# Altium schematic sheet ConectoresAdicionales.SchDoc
size A4
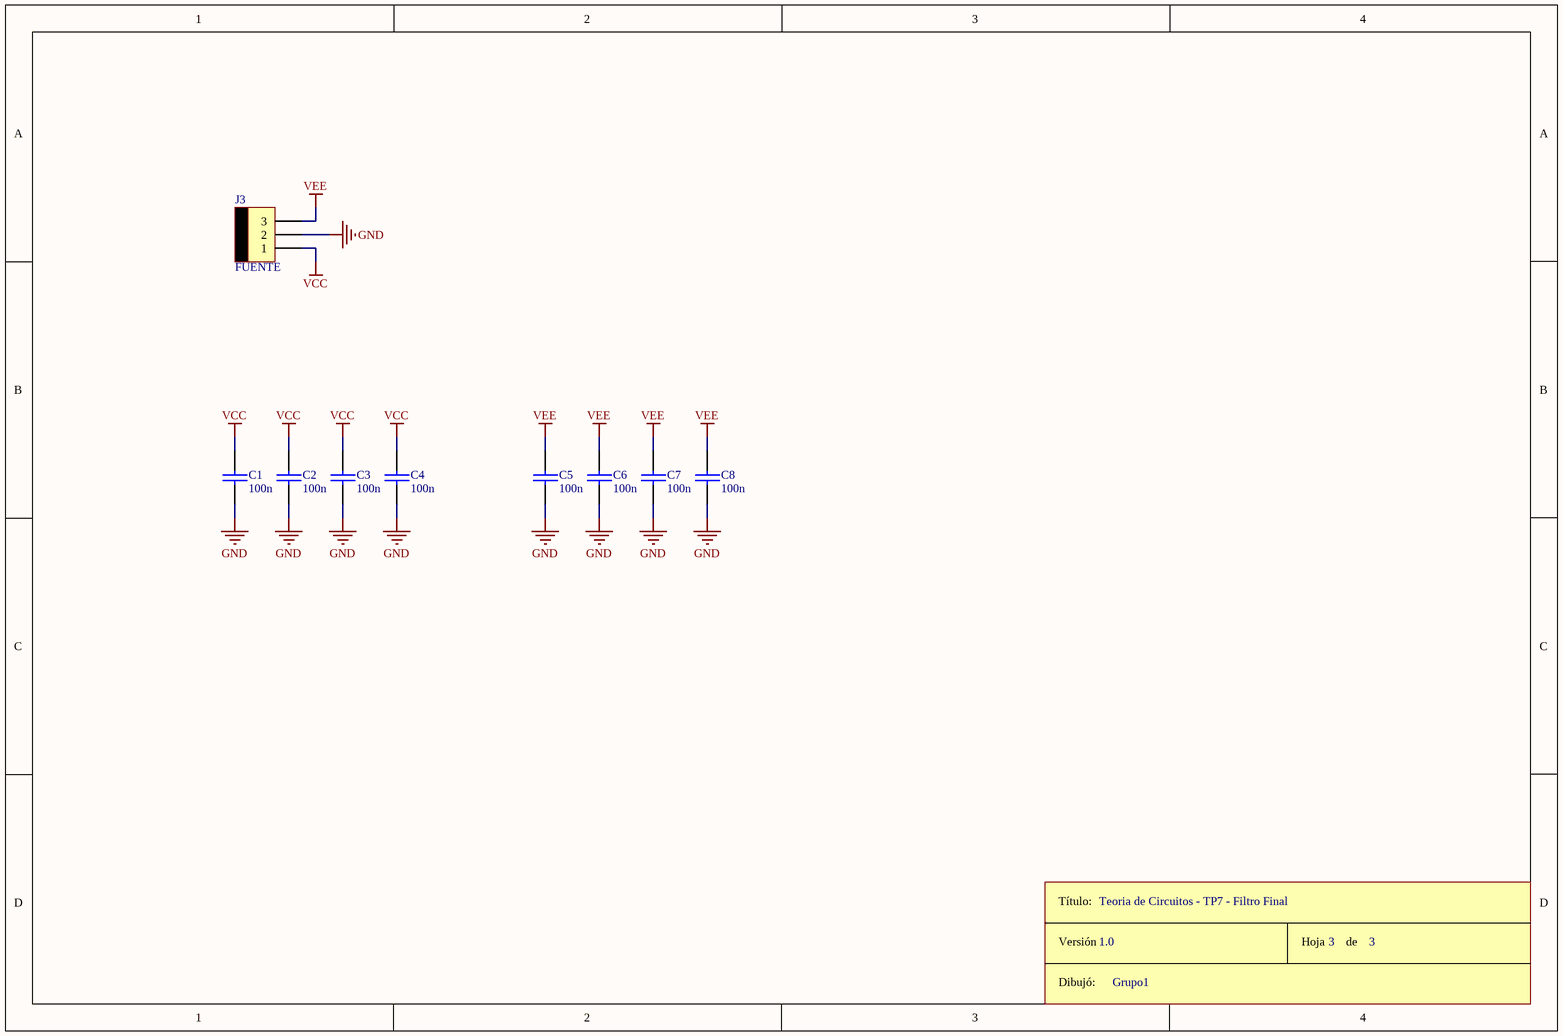
[diagram p0: ConectoresAdicionales.SchDoc]

## Parts
C1  100n  [CAP100]
C2  100n  [CAP100]
C3  100n  [CAP100]
C4  100n  [CAP100]
C5  100n  [CAP100]
C6  100n  [CAP100]
C7  100n  [CAP100]
C8  100n  [CAP100]
J3  FUENTE  [MOLEX3]
ROT3  Rótulo  (value not drawn)

## Nets
GND: C1.2 C2.2 C3.2 C4.2 C5.2 C6.2 C7.2 C8.2 J3.2
VCC: C1.1 C2.1 C3.1 C4.1 J3.1
VEE: C5.1 C6.1 C7.1 C8.1 J3.3

## Notes on the sheet
- Teoria de Circuitos - TP7 - Filtro Final
- 1.0
- Grupo1
- 3
- (in symbol Rótulo) Título:; Versión; Hoja       de; Dibujó:

## Library data of the parts
C1-C8 = CAP
J3 = MOLEX3